# EAGLE design powerSwitch004 (EAGLE 5.10)

## Sheet 1 of 2
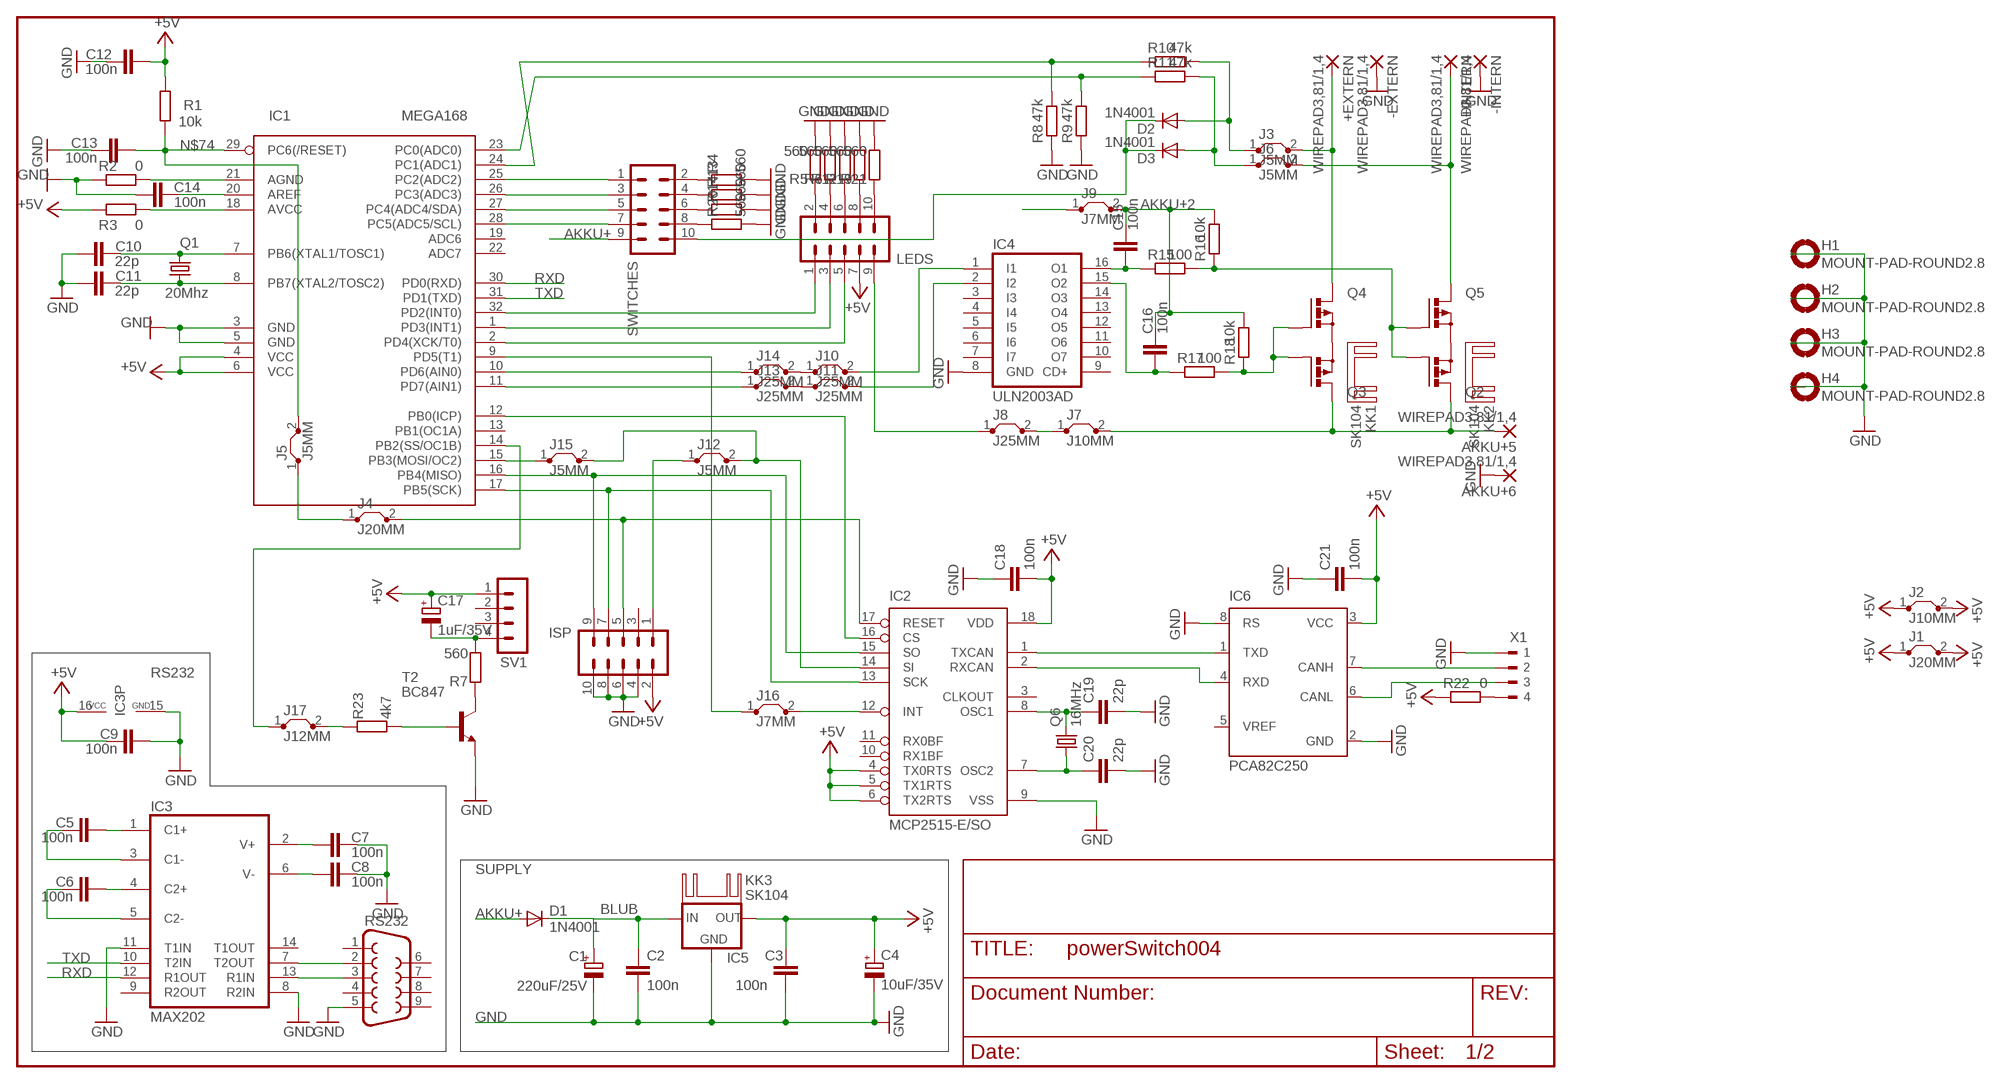
[diagram p0: schematic, sheet 1]

### Parts
+EXTERN  WIREPAD3,81/1,4  [3,81/1,4]
+INTERN  WIREPAD3,81/1,4  [3,81/1,4]
-EXTERN  WIREPAD3,81/1,4  [3,81/1,4]
-INTERN  WIREPAD3,81/1,4  [3,81/1,4]
AKKU+5  WIREPAD3,81/1,4  [3,81/1,4]
AKKU+6  WIREPAD3,81/1,4  [3,81/1,4]
C1  220uF/25V  CPOL-EUE3.5-8  [E3,5-8]
C2  100n  C-EUC0603K  [C0603K]
C3  100n  C-EUC0603K  [C0603K]
C4  10uF/35V  CPOL-EUE2-5  [E2-5]
C5  100n  C-EUC0603K  [C0603K]
C6  100n  C-EUC0603K  [C0603K]
C7  100n  C-EUC0603K  [C0603K]
C8  100n  C-EUC0603K  [C0603K]
C9  100n  C-EUC0603K  [C0603K]
C10  22p  C-EUC0603K  [C0603K]
C11  22p  C-EUC0603K  [C0603K]
C12  100n  C-EUC0603K  [C0603K]
C13  100n  C-EUC0603K  [C0603K]
C14  100n  C-EUC0603K  [C0603K]
C15  100n  C-EUC0603K  [C0603K]
C16  100n  C-EUC0603K  [C0603K]
C17  1uF/35V  CPOL-EUE2-5  [E2-5]
C18  100n  C-EUC0603  [C0603]
C19  22p  C-EUC0603  [C0603]
C20  22p  C-EUC0603  [C0603]
C21  100n  C-EUC0603  [C0603]
D1  1N4001  1N4004  [DO41-10]
D2  1N4001  1N4004  [DO41-10]
D3  1N4001  1N4004  [DO41-10]
H1  MOUNT-PAD-ROUND2.8  [2,8-PAD]
H2  MOUNT-PAD-ROUND2.8  [2,8-PAD]
H3  MOUNT-PAD-ROUND2.8  [2,8-PAD]
H4  MOUNT-PAD-ROUND2.8  [2,8-PAD]
IC1  MEGA168  MEGA8-AI  [TQFP32-08]
IC2  MCP2515-E/SO  [SO18L]
IC3  MAX202  MAX3232CSE  [SO16]
IC4  ULN2003AD  [SO16]
IC5  78XXS  [78XXS]
IC6  PCA82C250  [DIL08]
ISP  socket  MA05-2  [MA05-2]
J1  J20MM  [20]
J2  J10MM  [10]
J3  J5MM  [05]
J4  J20MM  [20]
J5  J5MM  [05]
J6  J5MM  [05]
J7  J10MM  [10]
J8  J25MM  [25]
J9  J7MM  [07]
J10  J25MM  [25]
J11  J25MM  [25]
J12  J5MM  [05]
J13  J25MM  [25]
J14  J25MM  [25]
J15  J5MM  [05]
J16  J7MM  [07]
J17  J12MM  [12]
KK1  SK104  [SK104]
KK2  SK104  [SK104]
KK3  SK104  [SK104]
LEDS  leds  MA05-2  [MA05-2]
Q1  20Mhz  CRYTALHC49U-V  [HC49U-V]
Q2  PMOSFET_PTO220BV  [TO220BV]
Q3  PMOSFET_PTO220BV  [TO220BV]
Q4  PMOSFET_PTO220BV  [TO220BV]
Q5  PMOSFET_PTO220BV  [TO220BV]
Q6  16MHz  CRYSTALHC49U-V  [HC49U-V]
R1  10k  R-EU_R0805  [R0805]
R2  0  R-EU_R0805  [R0805]
R3  0  R-EU_R0805  [R0805]
R4  560  R-EU_R0805  [R0805]
R5  560  R-EU_R0805  [R0805]
R6  560  R-EU_R0805  [R0805]
R7  560  R-EU_R0805  [R0805]
R8  47k  R-EU_R0805  [R0805]
R9  47k  R-EU_R0805  [R0805]
R10  47k  R-EU_R0805  [R0805]
R11  47k  R-EU_R0805  [R0805]
R12  560  R-EU_R0805  [R0805]
R13  560  R-EU_R0805  [R0805]
R14  560  R-EU_R0805  [R0805]
R15  100  R-EU_R0805  [R0805]
R16  10k  R-EU_R0805  [R0805]
R17  100  R-EU_R0805  [R0805]
R18  10k  R-EU_R0805  [R0805]
R19  560  R-EU_R0805  [R0805]
R20  560  R-EU_R0805  [R0805]
R21  560  R-EU_R0805  [R0805]
R22  0  R-EU_M5923  [M5923]
R23  4k7  R-EU_R0805  [R0805]
RS232  socket  F09HP  [F09HP]
SV1  MA04-1  [MA04-1]
SWITCHES  switches  MA05-2  [MA05-2]
T2  BC847  [SOT23]
X1  90-4  [90-4]

### Nets
+5V: C3.1 C4.+ C9.1 C12.2 C17.+ C18.2 C21.2 IC1.4(VCC) IC1.6(VCC) IC2.4(TX0RTS) IC2.5(TX1RTS) IC2.6(TX2RTS) IC2.18(VDD) IC3.16(VCC) IC5.OUT IC6.3(VCC) ISP.2 J1.1 J1.2 J2.1 J2.2 LEDS.7 R1.2 R3.2 R22.2 SV1.1
AKKU+: D1.A J9.1 SWITCHES.9
AKKU+2: C15.2 C16.2 J9.2 R16.1 R18.1
BLUB: C1.+ C2.1 D1.C IC5.IN
GND: -EXTERN.1(P) -INTERN.1(P) AKKU+6.1(P) C1.- C2.2 C3.2 C4.- C7.2 C8.2 C9.2 C10.1 C11.1 C12.1 C13.1 C14.1 C18.1 C19.2 C20.2 C21.1 H1.B2,8(MOUNT) H2.B2,8(MOUNT) H3.B2,8(MOUNT) H4.B2,8(MOUNT) IC1.3(GND) IC1.5(GND) IC2.9(VSS) IC3.8(R2IN) IC3.11(T1IN) IC3.15(GND) IC4.8(GND) IC5.GND IC6.2(GND) IC6.8(RS) ISP.4 ISP.6 ISP.8 ISP.10 R2.2 R4.2 R5.2 R6.2 R8.2 R9.2 R12.2 R13.2 R14.2 R19.2 R20.2 R21.2 RS232.5 T2.2(E) X1.1
INT: IC1.9(PD5(T1)) J16.1
MISO: IC1.16(PB4(MISO)) IC2.15(SO) ISP.9
MOSI: IC2.14(SI) J12.2 J15.2
N$1: IC1.14(PB2(SS/OC1B)) J17.1
N$2: IC3.13(R1IN) RS232.3
N$3: IC3.7(T2OUT) RS232.2
N$4: C5.2 IC3.1(C1+)
N$5: C6.2 IC3.4(C2+)
N$6: C5.1 IC3.3(C1-)
N$7: C6.1 IC3.5(C2-)
N$8: C7.1 IC3.2(V+)
N$9: C8.1 IC3.6(V-)
N$10: C10.2 IC1.7(PB6(XTAL1/TOSC1)) Q1.2
N$11: C11.2 IC1.8(PB7(XTAL2/TOSC2)) Q1.1
N$12: Q3.D Q4.D
N$13: C14.2 IC1.20(AREF)
N$14: IC1.18(AVCC) R3.1
N$15: IC1.21(AGND) R2.1
N$16: Q2.D Q5.D
N$17: +INTERN.1(P) J6.2 Q5.S
N$18: R7.1 T2.3(C)
N$19: R13.1 SWITCHES.4
N$20: AKKU+5.1(P) J7.2 Q2.S Q3.S
N$21: IC1.23(PC0(ADC0)) R9.1 R11.2
N$22: +EXTERN.1(P) J3.2 Q4.S
N$24: J8.1 LEDS.9
N$31: R4.1 SWITCHES.2
N$32: IC1.10(PD6(AIN0)) J14.1
N$33: IC1.11(PD7(AIN1)) J13.1
N$34: IC1.2(PD4(XCK/T0)) LEDS.5
N$35: IC1.1(PD3(INT1)) LEDS.3
N$36: R14.1 SWITCHES.6
N$37: IC2.1(TXCAN) IC6.1(TXD)
N$38: IC2.2(RXCAN) IC6.4(RXD)
N$40: IC1.32(PD2(INT0)) LEDS.1
N$41: LEDS.4 R6.1
N$42: C15.1 IC4.16(O1) R15.2
N$43: Q2.G Q5.G R15.1 R16.2
N$44: LEDS.6 R12.1
N$45: C16.1 IC4.15(O2) R17.2
N$46: Q3.G Q4.G R17.1 R18.2
N$47: R20.1 SWITCHES.8
N$48: C19.1 IC2.8(OSC1) Q6.2
N$49: C20.1 IC2.7(OSC2) Q6.1
N$50: IC6.7(CANH) X1.2
N$51: IC6.6(CANL) X1.3
N$52: LEDS.2 R5.1
N$53: LEDS.8 R19.1
N$54: LEDS.10 R21.1
N$55: IC1.25(PC2(ADC2)) SWITCHES.1
N$56: IC1.26(PC3(ADC3)) SWITCHES.3
N$57: D2.A J3.1 R10.1
N$58: C17.- R7.2 SV1.4
N$59: IC1.27(PC4(ADC4/SDA)) SWITCHES.5
N$60: IC1.28(PC5(ADC5/SCL)) SWITCHES.7
N$61: R22.1 X1.4
N$62: R23.2 T2.1(B)
N$63: D2.C D3.C SWITCHES.10
N$64: D3.A J6.1 R11.1
N$65: IC4.1(I1) J10.2
N$66: IC1.24(PC1(ADC1)) R8.1 R10.2
N$67: IC4.2(I2) J11.2
N$68: ISP.1 J12.1
N$69: J11.1 J13.2
N$70: J10.1 J14.2
N$71: IC1.15(PB3(MOSI/OC2)) J15.1
N$72: IC2.12(INT) J16.2
N$73: J17.2 R23.1
N$74: C13.2 IC1.29(PC6(/RESET)) J5.2 R1.1
N$75: J4.1 J5.1
N$76: J7.1 J8.2
RST: IC2.17(RESET) ISP.5 J4.2
RXD: IC1.30(PD0(RXD)) IC3.12(R1OUT)
SCK: IC1.17(PB5(SCK)) IC2.13(SCK) ISP.7
SS: IC1.12(PB0(ICP)) IC2.16(CS)
TXD: IC1.31(PD1(TXD)) IC3.10(T2IN)
Unconnected: IC1.13(PB1(OC1A)) IC1.19(ADC6) IC1.22(ADC7) IC2.3(CLKOUT) IC2.10(RX1BF) IC2.11(RX0BF) IC3.9(R2OUT) IC3.14(T1OUT) IC4.3(I3) IC4.4(I4) IC4.5(I5) IC4.6(I6) IC4.7(I7) IC4.9(CD+) IC4.10(O7) IC4.11(O6) IC4.12(O5) IC4.13(O4) IC4.14(O3) IC6.5(VREF) ISP.3 RS232.1 RS232.4 RS232.6 RS232.7 RS232.8 RS232.9 SV1.2 SV1.3

### Notes on the sheet
- RS232
- SUPPLY

## Sheet 2 of 2

## Library data of the parts
+EXTERN +INTERN -EXTERN -INTERN AKKU+5 AKKU+6 = wirepad:WIREPAD: Wire PAD connect wire on PCB
C1 C4 C17 = rcl:CPOL-EU: POLARIZED CAPACITOR, European symbol
C2 C3 C5-C16 C18-C21 = rcl:C-EU: CAPACITOR, European symbol
D1-D3 = diode:1N4004: DIODE general purpose rectifier, 1 A
H1-H4 = holes:MOUNT-PAD-ROUND: MOUNTING PAD, round
IC1 = atmel:MEGA8: MICROCONTROLLER 8 Kbytes FLASH 1 kbytes SRAM 512 bytes EEPROM USART 6-channel 10 bit ADC 2-channel 8 bit ADC Source: avr.lbr
IC2 = mcp2515:MCP2515
IC3 = maxim:MAX3232*: True RS-232 Transceivers 3.0V to 5.5V, Low-Power up to 1Mbps, Using Four 0.1µF External Capacitors Source: http://pdfserv.maxim-ic.com/en/ds/MAX3222-MAX3241.pdf
IC4 = uln-udn:ULN2003A: DRIVER ARRAY
IC5 = v-reg:78XXS: VOLTAGE REGULATOR
IC6 = micro-philips:PCA82C250: CAN CONTROLLER INTERFACE
ISP LEDS SWITCHES = con-lstb:MA05-2: PIN HEADER
J1-J17 = jumper:J: Bridge
KK1-KK3 = heatsink:SK104: HEATSINK manufacturer Fischer/distributor Buerklin
Q1 = crystal:CRYTAL: CRYSTAL
Q2-Q5 = transistor-power:PMOSFET_P: Power MOSFET P-Channel
Q6 = crystal:CRYSTAL: CRYSTAL
R1-R23 = rcl:R-EU_: RESISTOR, European symbol
RS232 = con-subd:F09: SUB-D
SV1 = con-lstb:MA04-1: PIN HEADER
T2 = transistor:BC847: NPN TRANSISTOR
X1 = con-weidmueller-sl35:90-4: WEIDMUELLER CLAMP CONNECTOR

## Board
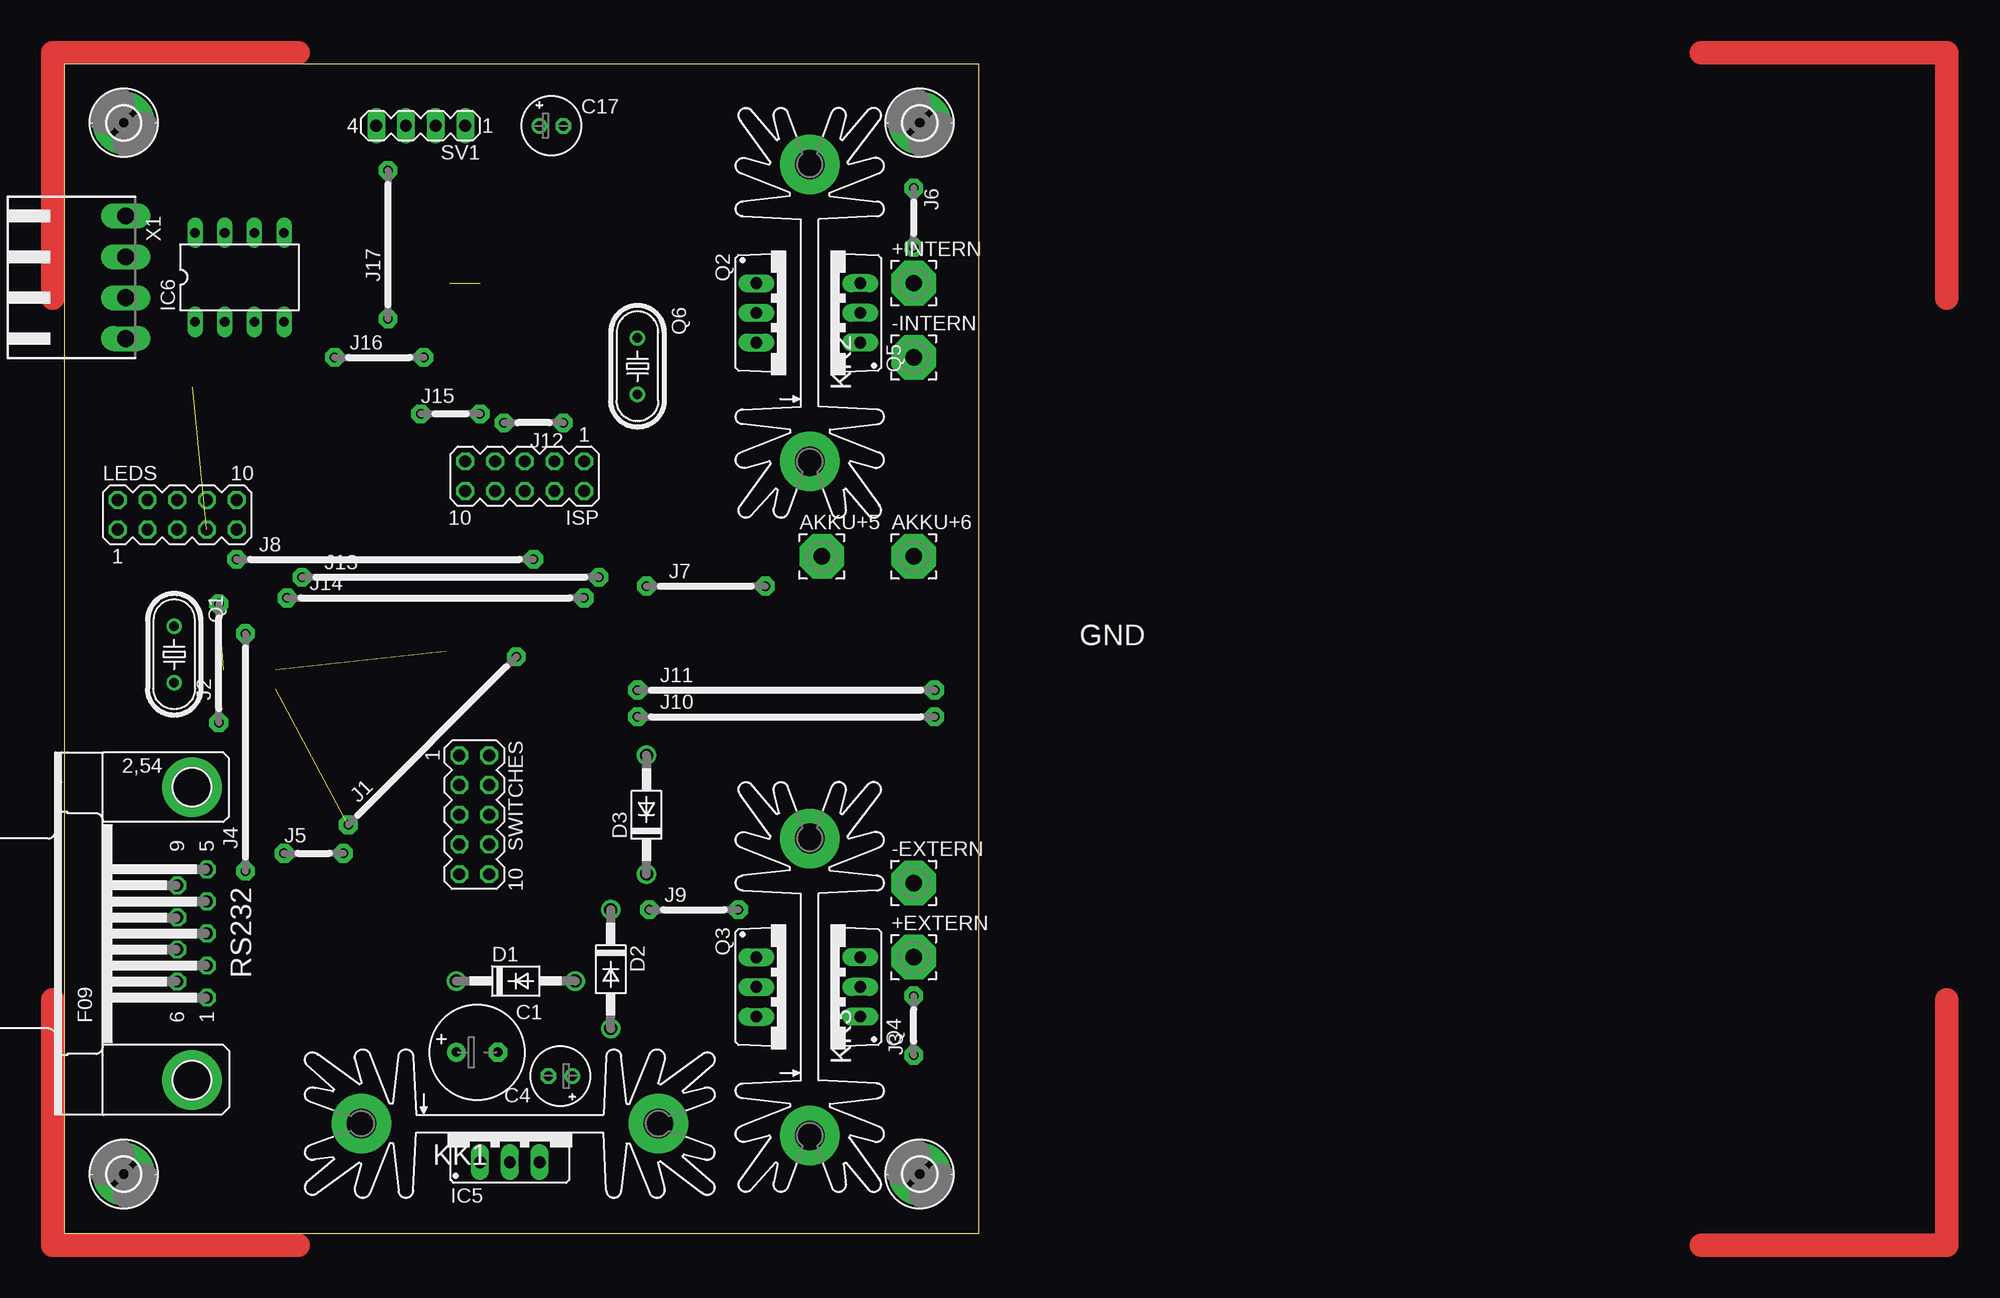
[diagram p1: board, top side]
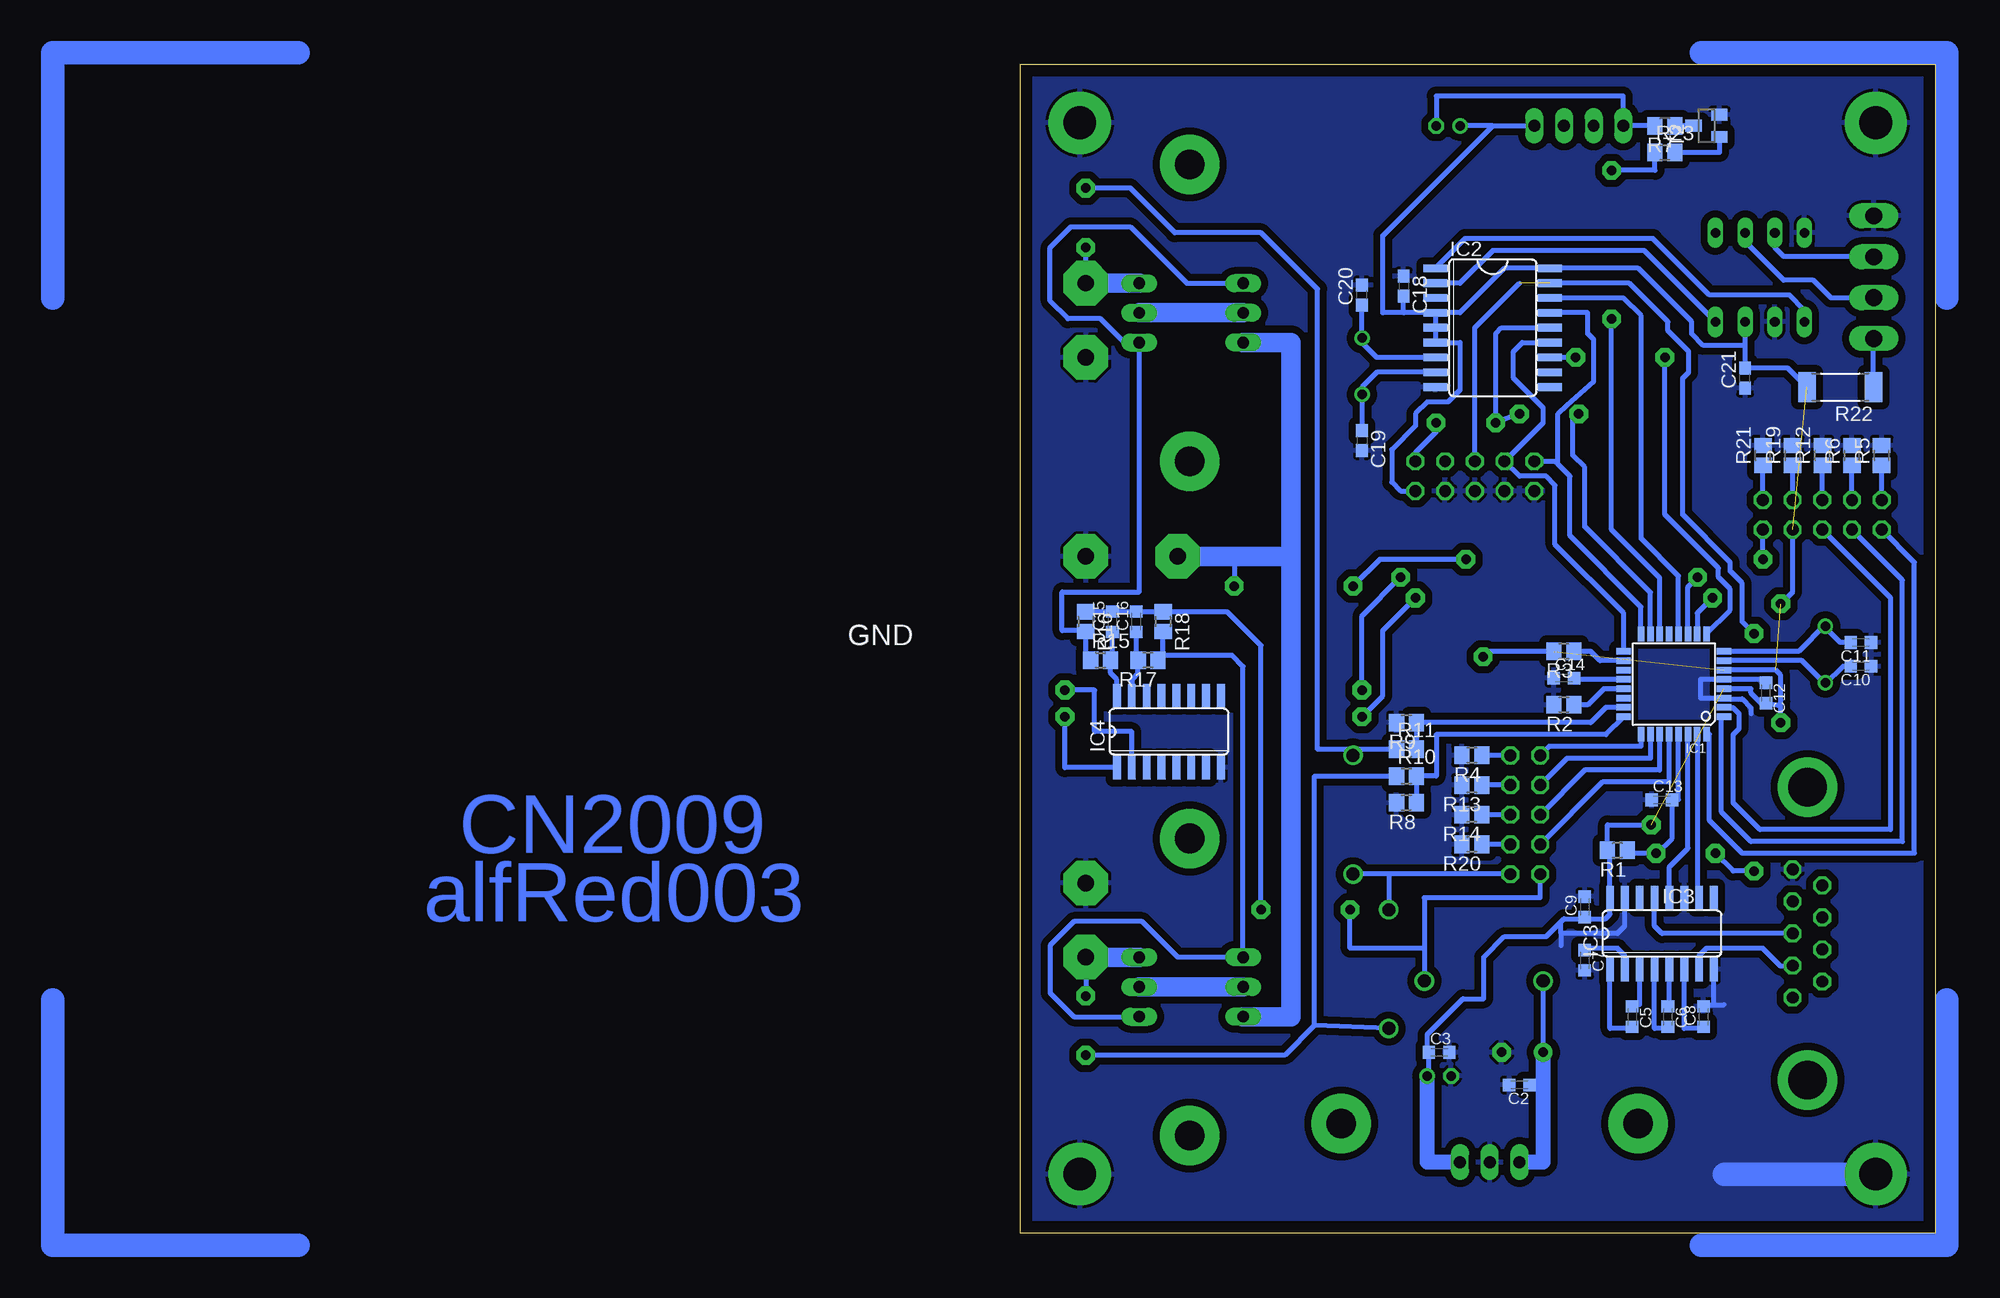
[diagram p2: board, bottom side, seen from below]

Size 78.21 x 100 mm. Coordinates in mm from the lower left corner, seen from the top.
Outline: 0,0 78.21,0 78.21,100 0,100 0,0
Copper layers (1*16): Top 0.035mm / dielectric 1.5mm / Bottom 0.035mm
Design rules "olimex_8mils": minimum track width 10mil, minimum drill 24mil, track to track 8mil, track to pad 8mil, pad to pad 8mil, via to via 8mil, smd to smd 8mil, copper to edge 40mil, drill to drill 10mil, minimum pad ring 10mil, minimum via ring 8mil, stop-mask expansion 0mil, vias tented up to drill 0mil, thermal gap 10mil

### Footprints (pad centres in the part's own frame; a part is rotated, then mirrored left to right if it is on the bottom)
3,81/1,4 = drill 1.397 pad 3.81 octagon: 1 0,0
E3,5-8 = drill 0.813 pad 1.6 round: + -1.778,0 | drill 0.813 pad 1.6 octagon: - 1.778,0
C0603K = smd 1.05 x 1.08: 1 -0.875,0; 2 0.875,0
E2-5 = drill 0.813 pad 1.27 round: + -1.016,0 | drill 0.813 pad 1.27 octagon: - 1.016,0
C0603 = smd 1.1 x 1: 1 -0.85,0; 2 0.85,0
DO41-10 = drill 1.118 round: A 5.08,0; C -5.08,0
2,8-PAD = drill 2.8 pad 5.334 round: B2,8 0,0
TQFP32-08 = smd 1.27 x 0.559: 1 -4.293,2.8; 2 -4.293,2; 3 -4.293,1.2; 4 -4.293,0.4; 5 -4.293,-0.4; 6 -4.293,-1.2; 7 -4.293,-2; 8 -4.293,-2.8; 17 4.293,-2.8; 18 4.293,-2; 19 4.293,-1.2; 20 4.293,-0.4; 21 4.293,0.4; 22 4.293,1.2; 23 4.293,2; 24 4.293,2.8 | smd 0.559 x 1.27: 9 -2.8,-4.293; 10 -2,-4.293; 11 -1.2,-4.293; 12 -0.4,-4.293; 13 0.4,-4.293; 14 1.2,-4.293; 15 2,-4.293; 16 2.8,-4.293; 25 2.8,4.293; 26 2,4.293; 27 1.2,4.293; 28 0.4,4.293; 29 -0.4,4.293; 30 -1.2,4.293; 31 -2,4.293; 32 -2.8,4.293
SO18L = smd 0.66 x 2.032: 1 -5.08,-4.902; 2 -3.81,-4.902; 3 -2.54,-4.902; 4 -1.27,-4.902; 5 0,-4.902; 6 1.27,-4.902; 7 2.54,-4.902; 8 3.81,-4.902; 9 5.08,-4.902; 10 5.08,4.902; 11 3.81,4.902; 12 2.54,4.902; 13 1.27,4.902; 14 0,4.902; 15 -1.27,4.902; 16 -2.54,4.902; 17 -3.81,4.902; 18 -5.08,4.902
SO16 = smd 0.66 x 2.032: 1 -4.445,-3.073; 2 -3.175,-3.073; 3 -1.905,-3.073; 4 -0.635,-3.073; 5 0.635,-3.073; 6 1.905,-3.073; 7 3.175,-3.073; 8 4.445,-3.073; 9 4.445,3.073; 10 3.175,3.073; 11 1.905,3.073; 12 0.635,3.073; 13 -0.635,3.073; 14 -1.905,3.073; 15 -3.175,3.073; 16 -4.445,3.073
78XXS = drill 1.016 long: GND 0,-2.54; IN -2.54,-2.54; OUT 2.54,-2.54
DIL08 = drill 0.813 long: 1 -3.81,-3.81; 2 -1.27,-3.81; 3 1.27,-3.81; 4 3.81,-3.81; 5 3.81,3.81; 6 1.27,3.81; 7 -1.27,3.81; 8 -3.81,3.81
MA05-2 = drill 1.016 octagon: 1 -5.08,-1.27; 2 -5.08,1.27; 3 -2.54,-1.27; 4 -2.54,1.27; 5 0,-1.27; 6 0,1.27; 7 2.54,-1.27; 8 2.54,1.27; 9 5.08,-1.27; 10 5.08,1.27
20 = drill 0.813 pad 1.6 octagon: 1 -10.16,0; 2 10.16,0
10 = drill 0.813 pad 1.6 octagon: 1 -5.08,0; 2 5.08,0
05 = drill 0.813 pad 1.6 octagon: 1 -2.54,0; 2 2.54,0
25 = drill 0.813 pad 1.6 octagon: 1 -12.7,0; 2 12.7,0
07 = drill 0.813 pad 1.6 octagon: 1 -3.81,0; 2 3.81,0
12 = drill 0.813 pad 1.6 octagon: 1 -6.35,0; 2 6.35,0
SK104 = drill 2.54 pad 5.08 round: A2,5 -12.7,-0.762; B2,5 12.7,-0.762
HC49U-V = drill 0.813 round: 1 -2.413,0; 2 2.413,0
TO220BV = drill 1.016 long: D 0,-2.54; G -2.54,-2.54; S 2.54,-2.54
R0805 = smd 1.3 x 1.5: 1 -0.85,0; 2 0.85,0
M5923 = smd 1.5 x 2.6: 1 -2.85,0; 2 2.85,0
F09HP = drill 1.016 octagon: 1 -5.486,-1.27; 2 -2.743,-1.27; 3 0,-1.27; 4 2.743,-1.27; 5 5.486,-1.27; 6 -4.115,1.27; 7 -1.372,1.27; 8 1.372,1.27; 9 4.115,1.27 | drill 3.302 pad 5.08 round: G1 -12.522,0; G2 12.522,0
MA04-1 = drill 1.016 long: 1 -3.81,0; 2 -1.27,0; 3 1.27,0; 4 3.81,0
SOT23 = smd 1 x 1.4: 1 -0.95,-1.1; 2 0.95,-1.1; 3 0,1.1
90-4 = drill 1.422 long: 1 -5.25,5.25; 2 -1.75,5.25; 3 1.75,5.25; 4 5.25,5.25

### Placement (x,y rotation side)
+EXTERN  72.64,23.62 0 top
+INTERN  72.64,81.28 0 top
-EXTERN  72.64,29.97 0 top
-INTERN  72.64,74.93 0 top
AKKU+5  64.77,57.91 0 top
AKKU+6  72.64,57.91 0 top
C1  35.31,15.49 0 top
C2  35.56,12.7 180 bottom
C3  42.42,15.49 0 bottom
C4  42.42,13.46 180 top
C5  25.91,18.54 270 bottom
C6  22.86,18.54 270 bottom
C7  29.97,23.37 270 bottom
C8  19.81,18.54 90 bottom
C9  29.97,27.94 90 bottom
C10  6.35,48.51 180 bottom
C11  6.35,50.55 180 bottom
C12  14.48,46.23 270 bottom
C13  23.37,37.08 0 bottom
C14  31.75,47.5 0 bottom
C15  70.36,52.32 90 bottom
C16  68.33,52.32 90 bottom
C17  41.66,94.74 0 top
C18  45.47,81.03 270 bottom
C19  49.02,67.82 270 bottom
C20  49.02,80.26 90 bottom
C21  16.26,73.15 90 bottom
D1  38.61,21.59 0 top
D2  46.74,22.61 270 top
D3  49.78,35.81 90 top
H1  73.15,5.08 90 top
H2  5.08,5.08 90 top
H3  5.08,95 90 top
H4  73.15,95 90 top
IC1  22.35,46.99 180 bottom
IC2  37.85,77.47 270 bottom
IC3  23.37,25.65 0 bottom
IC4  65.53,42.93 0 bottom
IC5  38.1,8.64 0 top
IC6  14.99,81.79 0 top
ISP  39.37,64.77 180 top
J1  31.47,42.13 45 top
J2  13.21,48.77 90 top
J3  72.64,17.78 90 top
J4  15.49,41.15 90 top
J5  21.34,32.51 0 top
J6  72.64,86.87 270 top
J7  54.86,55.37 0 top
J8  27.43,57.66 0 top
J9  53.85,27.69 0 top
J10  61.72,44.2 0 top
J11  61.72,46.48 0 top
J12  40.13,69.34 180 top
J13  33.02,56.13 0 top
J14  31.75,54.36 0 top
J15  33.02,70.1 0 top
J16  26.92,74.93 0 top
J17  27.69,84.58 90 top
KK1  38.1,10.16 0 top
KK2  62.99,78.74 90 top
KK3  62.99,21.08 90 top
LEDS  9.65,61.47 0 top
Q1  9.4,49.53 270 top
Q2  61.72,78.74 270 top
Q3  61.72,21.08 270 top
Q4  65.53,21.08 90 top
Q5  65.53,78.74 90 top
Q6  49.02,74.17 270 top
R1  27.18,32.77 180 bottom
R2  31.75,45.21 180 bottom
R3  31.75,49.78 180 bottom
R4  39.62,40.89 180 bottom
R5  4.57,66.55 90 bottom
R6  7.11,66.55 90 bottom
R7  23.11,94.74 180 bottom
R8  45.21,36.83 180 bottom
R9  45.21,43.69 180 bottom
R10  45.21,39.12 0 bottom
R11  45.21,41.4 0 bottom
R12  9.65,66.55 90 bottom
R13  39.62,38.35 180 bottom
R14  39.62,35.81 180 bottom
R15  71.37,49.02 0 bottom
R16  72.64,52.32 270 bottom
R17  67.31,49.02 180 bottom
R18  66.04,52.32 270 bottom
R19  12.19,66.55 90 bottom
R20  39.62,33.27 180 bottom
R21  14.73,66.55 90 bottom
R22  8.13,72.39 180 bottom
R23  23.11,92.46 0 bottom
RS232  10.92,25.65 90 top
SV1  30.48,94.74 180 top
SWITCHES  35.05,35.81 270 top
T2  19.56,94.74 90 bottom
X1  0,81.79 270 top

### Tracks (layer width: path | path; a pad name or v marks a point on that pad's centre or on a via)
+5V  (4 unrouted)
  Bottom 0.406: IC1.4 15.75,46.59 15.75,46.23 14.73,45.21 C12.2 | IC1.6 13.65,48.19 13.21,47.75 13.21,45.72 | C12.2 13.32,45.1 13.21,45.72 | C12.2 14.48,45.21 | J2.1 13.21,45.72 | C4.+ 43.29,13.6 C3.1 43.43,15.63 43.43,17.02 40.39,20.07 38.61,20.07 38.61,23.62 36.83,25.4 33.27,25.4 31.75,26.92 30.23,26.92 C9.1 29.97,26.92 28.19,26.92 27.81,27.3 IC3.16 27.81,32.77 R1.2 28.03,34.95 J1.1 | LEDS.7 12.19,54.86 J2.2 | IC2.4 40.64,78.74 36.83,82.55 IC2.18 25.4,82.55 20.83,77.98 20.83,76.96 19.81,75.95 16.26,75.95 | 16.26,75.95 IC6.3 | 16.26,75.95 C21.2 12.59,74 R22.2 | IC2.4 IC2.5 IC2.6 40.64,76.2 40.64,72.14 41.66,71.12 43.43,71.12 44.45,70.1 44.45,69.09 46.48,67.06 46.48,64.26 45.72,63.5 ISP.2 | IC2.4 45.47,78.74 | 45.47,78.74 47.24,78.74 47.24,85.34 37.85,94.74 | 37.85,94.74 SV1.1 | 37.85,94.74 C17.+ | 45.47,78.74 C18.2 | R3.2 38.18,49.78 J1.2
  Bottom 1.27: C4.+ 43.43,6.1 IC5.OUT
AKKU+
  Bottom 0.406: 43.69,24.38 D1.A | SWITCHES.9 33.78,28.7 43.69,28.7 43.69,24.38 | 43.69,24.38 50.04,24.38 J9.1
AKKU+2
  Bottom 0.406: 68.33,53.17 R18.1 60.54,53.17 57.66,50.29 J9.2 | 68.33,53.17 70.61,53.17 | 70.61,53.17 R16.1 | 68.33,53.17 C16.2 | C15.2 70.59,53.2 70.61,53.17
BLUB
  Bottom 0.406: 33.53,12.7 C2.1 | C1.+ D1.C
  Bottom 1.27: C1.+ 33.53,12.7 33.53,6.1 IC5.IN
GND
  Bottom 0.406: IC3.15 26.54,26.29 27.18,25.65 32,25.65 | 32,25.65 32,26.67 | 32,25.65 32,24.64 | C8.2 19.81,19.56 18.92,19.56 | 18.92,19.56 IC3.8 | 18.92,19.56 18.03,19.56 | 15.75,44.45 15.75,44.96 16.51,45.72 18.03,45.72 18.06,45.74 IC1.3 20.07,45.79 20.07,47.39 IC1.5 14.48,47.39 C12.1
  Bottom 2: 4.83,5.08 H2.B2,8 18.03,5.08
  pour Top (isolate 0.254): -27.94,55.88 -26.67,53.34 -26.67,2.54 -27.94,5.08
  pour Bottom (isolate 0.61): -0.25,100.33 160.27,100.33 160.27,-0.25 -0.25,-0.25
INT
  Bottom 0.406: IC1.9 19.55,51.31 17.53,53.34 17.53,55.12 18.54,56.13 18.54,56.9 23.11,61.47 J16.1
MISO
  Bottom 0.406: IC2.15 29.72,78.74 29.72,76.96 29.21,76.45 29.21,72.9 31.5,70.87 32.26,70.1 32.26,65.79 | IC1.16 25.15,53.6 31.24,59.69 31.24,64.77 32.26,65.79 | 32.26,65.79 32.51,66.04 ISP.9
MOSI
  Bottom 0.406: IC2.14 37.08,77.47 37.59,76.96 J12.2 J15.2
N$1
  Bottom 0.406: IC1.14 23.55,56.06 27.69,60.2 J17.1
N$2
  Bottom 0.406: IC3.13 24,26.29 23.37,25.65 RS232.3
N$3
  Bottom 0.406: 20.19,22.48 IC3.7 20.19,23.75 19.56,24.38 14.73,24.38 13.21,22.86 12.19,22.86
  Bottom 0.61: RS232.2 12.19,22.86
N$4
  Bottom 0.406: C5.2 26.42,17.53 27.81,17.53 IC3.1
N$5
  Bottom 0.406: C6.2 23.11,17.53 24,17.53 IC3.4
N$6
  Bottom 0.406: C5.1 25.91,19.56 25.27,19.56 IC3.3
N$7
  Bottom 0.406: C6.1 23.11,19.56 22.73,19.56 IC3.5
N$8
  Bottom 0.406: IC3.2 26.54,23.75 27.18,24.38 29.72,24.38 C7.1
N$9
  Bottom 0.406: C8.1 19.81,17.53 21.46,17.53 IC3.6
N$10
  Bottom 0.406: IC1.7 11.4,48.99 9.4,46.99 | 9.4,46.99 Q1.2 | C10.2 7.87,48.51 9.4,46.99
N$11
  Bottom 0.406: IC1.8 11.68,49.79 9.4,52.07 Q1.1 9.4,51.82 8.13,50.55 C11.2
N$12
  Bottom 1.676: Q3.D Q4.D
N$13
  Bottom 0.406: C14.2 30.99,47.5 30.88,47.39 IC1.20
N$14
  Bottom 0.406: IC1.18 28.67,48.99 29.46,49.78 R3.1 30.99,49.78
N$15
  Bottom 0.406: IC1.21 28.34,46.59 29.72,45.21 R2.1
N$16
  Bottom 1.676: Q2.D Q5.D
N$17
  Bottom 0.406: +INTERN.1 J6.2
  Bottom 1.676: Q5.S +INTERN.1
N$18
  Bottom 0.406: T2.3 R7.1
N$19
  Bottom 0.406: SWITCHES.4 R13.1
N$20
  Bottom 0.406: J7.2 59.94,57.91 59.69,57.91
  Bottom 1.676: Q3.S 55.12,18.54 55.12,57.91 | 55.12,57.91 55.12,76.2 Q2.S | 55.12,57.91 59.69,57.91 AKKU+5.1
N$21
  Bottom 0.406: IC1.23 28.16,44.99 29.46,43.69 R9.1 R11.2
N$22
  Bottom 0.406: +EXTERN.1 J3.2
  Bottom 1.676: Q4.S +EXTERN.1
N$23
  Top 2: 20,-1 -1,-1 -1,20
N$24
  Bottom 0.406: J8.1 LEDS.9
N$25
  Top 2: 140,-1 161,-1 161,20
N$26
  Top 2: 20,101 -1,101 -1,80
N$27
  Top 2: 161,80 161,101 140,101
N$28
  Bottom 2: 20,-1 -1,-1 -1,20
N$29
  Bottom 2: 140,-1 161,-1 161,20
N$30
  Bottom 2: 20,101 -1,101 -1,80
N$31
  Bottom 0.406: SWITCHES.2 R4.1
N$32
  Bottom 0.406: IC1.10 20.35,53.05 J14.1
N$33
  Bottom 0.406: IC1.11 21.15,55.3 J13.1
N$34
  Bottom 0.406: IC1.2 17.27,44.96 16.76,44.45 16.76,43.18 17.27,42.67 17.27,36.83 14.99,34.54 3.81,34.54 3.81,54.36 LEDS.5
N$35
  Bottom 0.406: IC1.1 18.29,44.19 18.29,36.07 15.75,33.53 2.79,33.53 2.79,55.88 LEDS.3
N$36
  Bottom 0.406: SWITCHES.6 R14.1
N$37
  Bottom 0.406: IC2.1 40.21,85.09 24.13,85.09 19.3,80.26 12.45,80.26 11.18,78.99 IC6.1
N$38
  Bottom 0.406: IC2.2 40.64,81.28 37.85,84.07 24.89,84.07 IC6.4
N$39
  Bottom 2: 161,80 161,101 140,101
N$40
  Bottom 0.406: IC1.32 19.3,42.7 19.3,35.31 16.51,32.51 1.78,32.51 1.78,57.4 LEDS.1
N$41
  Bottom 0.406: LEDS.4 R6.1
N$42
  Bottom 0.406: IC4.16 69.98,47.37 70.52,47.92 R15.2 70.36,49.19 C15.1
N$43
  Bottom 0.406: Q2.G 64.01,81.28 68.83,86.11 73.91,86.11 75.69,84.33 75.69,79.76 74.17,78.23 71.37,78.23 69.34,76.2 Q5.G 68.07,54.86 74.68,54.86 74.68,51.56 72.73,51.56 R16.2 72.64,49.44 R15.1
N$44
  Bottom 0.406: LEDS.6 R12.1
N$45
  Bottom 0.406: IC4.15 68.71,47.37 68.16,47.92 R17.2 68.33,49.19 C16.1
N$46
  Bottom 0.406: Q4.G 73.66,18.54 75.69,20.57 75.69,24.64 73.66,26.67 67.82,26.67 64.77,23.62 Q3.G 59.18,48.51 60.11,49.44 66.04,49.44 | 66.04,49.44 R18.2 | 66.04,49.44 R17.1
N$47
  Bottom 0.406: SWITCHES.8 R20.1
N$48
  Bottom 0.406: IC2.8 47.75,73.66 49.02,72.39 Q6.2 C19.1
N$49
  Bottom 0.406: IC2.7 47.75,74.93 49.02,76.2 Q6.1 C20.1
N$50
  Bottom 0.406: IC6.7 13.72,84.33 12.95,83.57 5.28,83.57 X1.2
N$51
  Bottom 0.406: IC6.6 16.26,84.84 12.95,81.53 10.41,81.53 8.89,80.01 5.28,80.01 X1.3
N$52
  Bottom 0.406: LEDS.2 R5.1
N$53
  Bottom 0.406: LEDS.8 R19.1
N$54
  Bottom 0.406: LEDS.10 R21.1
N$55
  Bottom 0.406: SWITCHES.1 33.02,41.66 25.15,41.66 IC1.25
N$56
  Bottom 0.406: SWITCHES.3 31.5,40.64 24.35,40.64 IC1.26
N$57
  Bottom 0.406: J3.1 55.63,15.24 53.09,17.78 | 53.09,17.78 53.09,39.12 R10.1 | D2.A 53.09,17.78
N$58
  Bottom 0.406: R7.2 SV1.4 26.67,97.28 42.67,97.28 C17.-
N$59
  Bottom 0.406: SWITCHES.5 29.97,39.62 23.55,39.62 IC1.27
N$60
  Bottom 0.406: SWITCHES.7 28.45,38.61 22.75,38.61 IC1.28
N$61
  Bottom 0.406: R22.1 5.28,76.51 X1.4
N$62
  Bottom 0.406: R23.2 18.46,92.46 T2.1
N$63
  Bottom 0.406: SWITCHES.10 46.74,30.73 | 46.74,30.73 D3.C | 46.74,30.73 D2.C
N$64
  Bottom 0.406: J6.1 68.83,89.41 65.02,85.6 57.66,85.6 52.83,80.77 52.83,41.4 49.78,41.4 | R11.1 49.78,41.4 | 49.78,41.4 D3.A
N$65
  Bottom 0.406: IC4.1 74.42,39.85 J10.2
N$66
  Bottom 0.406: IC1.24 28.16,42.67 42.67,42.67 42.67,39.12 R10.2 R8.1
N$67
  Bottom 0.406: IC4.2 68.71,42.93 71.88,42.93 71.88,46.48 J11.2
N$68
  Bottom 0.406: ISP.1 44.45,66.8 42.67,68.58 J12.1
N$69
  Bottom 0.406: J11.1 49.02,52.83 J13.2
N$70
  Bottom 0.406: J14.2 47.24,51.56 47.24,45.97 J10.1
N$71
  Bottom 0.406: IC1.15 24.35,54.83 29.97,60.45 29.97,65.53 30.99,66.55 30.99,69.6 J15.1
N$72
  Bottom 0.406: J16.2 IC2.12
N$73
  Bottom 0.406: J17.2 23.96,90.93 R23.1
N$74
  Bottom 0.406: IC1.29 21.95,37.12 C13.2 22.49,33.81 23.79,32.51 J5.2 26.07,32.51 R1.1
N$75
  Bottom 0.406: J4.1 17.27,30.99 J5.1
N$76
  Bottom 0.406: J7.1 47.5,57.66 J8.2
RST  (1 unrouted)
  Bottom 0.406: ISP.5 39.37,77.47 35.56,81.28 | IC2.17 26.16,81.28 22.86,77.98 22.86,77.22 21.08,75.44 21.08,73.66 21.59,73.15 21.59,61.47 17.53,57.4 17.53,56.64 16.51,55.63 16.51,52.32 J4.2
RXD
  Bottom 0.406: IC1.30 21.15,32.95 22.73,31.37 IC3.12
SCK
  Bottom 0.406: IC1.17 26.64,53.06 32.51,58.93 32.51,64.01 33.27,64.77 35.56,64.77 ISP.7 33.53,69.34 33.53,70.61 36.07,73.15 36.07,75.44 35.31,76.2 IC2.13
SS
  Bottom 0.406: IC1.12 21.95,56.24 25.15,59.44 25.15,78.49 26.67,80.01 IC2.16
TXD
  Bottom 0.406: IC1.31 20.33,42.67 20.32,42.67 20.32,28.85 IC3.10

### Text on the board
Bottom: CN2009 | alfRed003
tNames: GND
bNames: GND